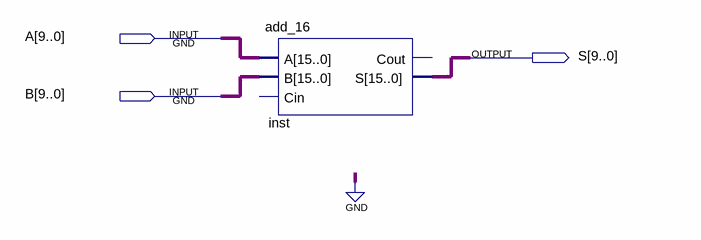
[diagram p0: schematic sheet]
// Quartus schematic add_10.bdf as structural Verilog: 1 symbols, 3 pins
module add_10 (
  input  [9:0] A,
  input  [9:0] B,
  output [15:0] S
);

  add_16 inst (.A({{6{1'b0}}, A}), .B({{6{1'b0}}, B}), .S(S));  // open: Cin, Cout
endmodule
